# EasyEDA schematic 1-Schematic_NRF52832_Touch_Switch_1ch.json
TITLE: NRF52832_Touch_Switch_1ch; REV: 0.1; Date: 2019-11-19; Sheet: 1/1; Drawn By: mtiutiu; Company: TIU-TECH
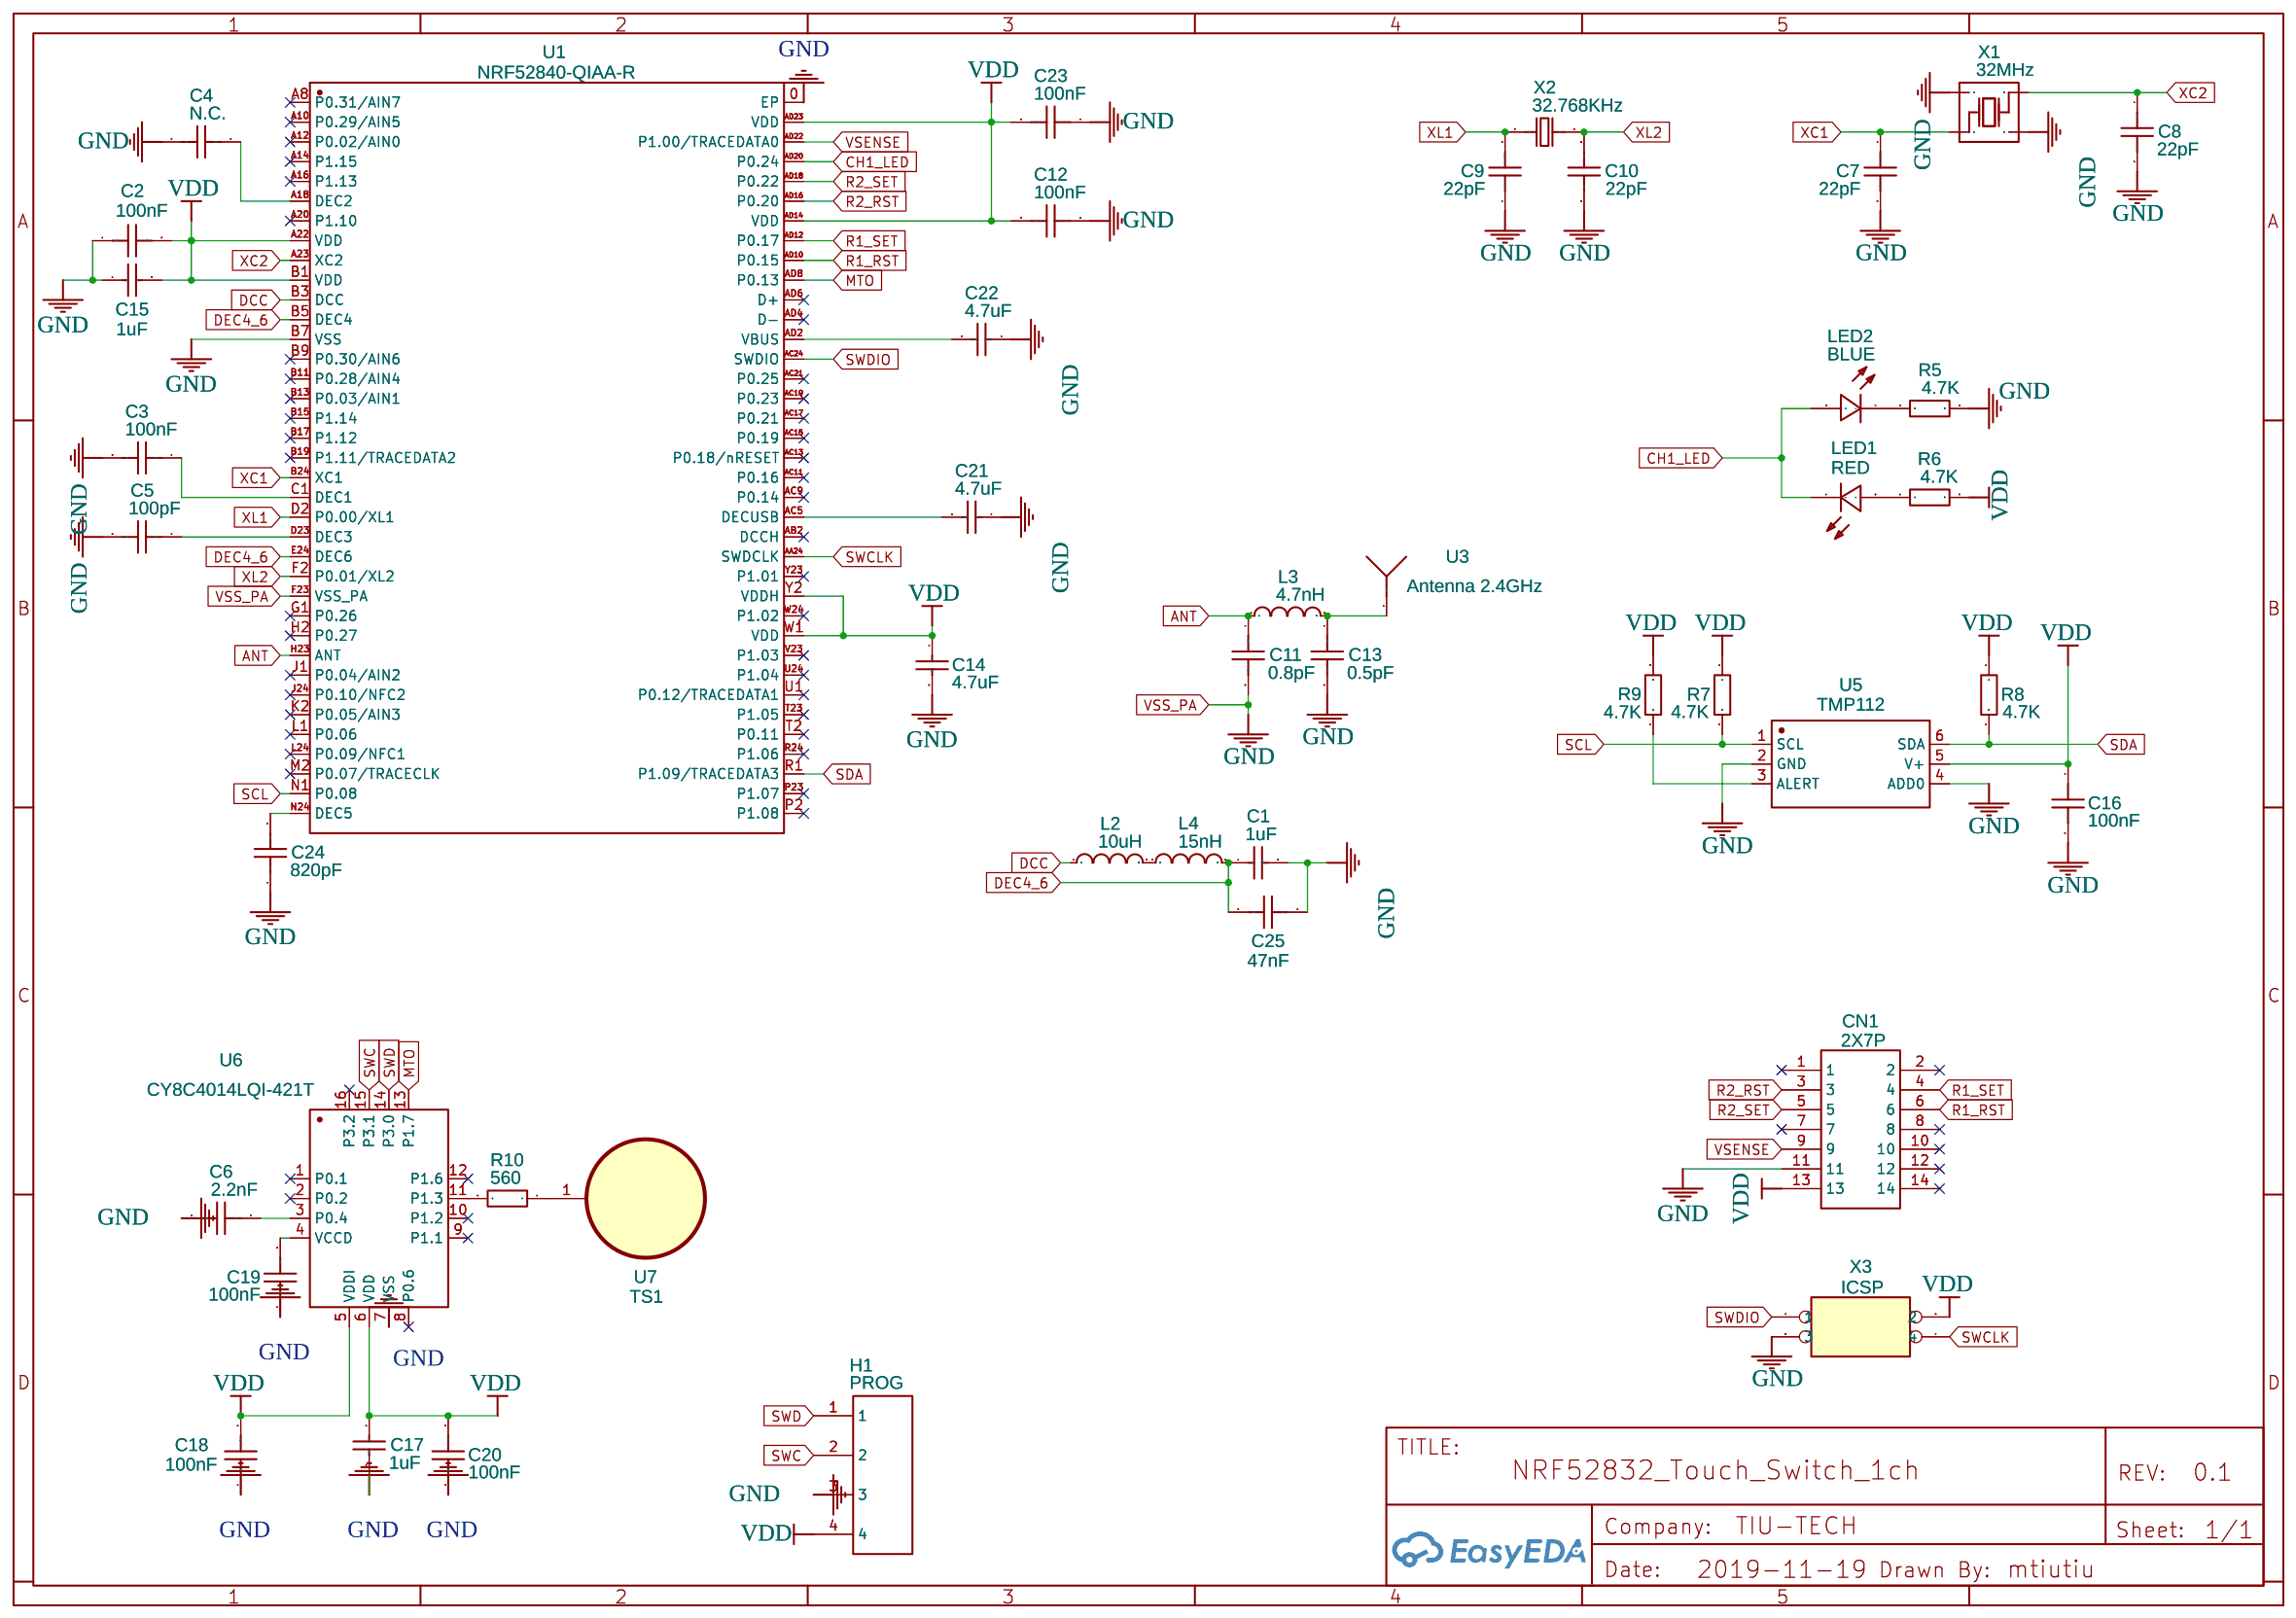
[diagram p0: schematic sheet]

## Parts
C1  1uF  [0603]
C2  100nF  [C0603]
C3  100nF  [C0603]
C4  N.C.  [0603]
C5  100pF  [0603]
C6  2.2nF  [C0603]
C7  22pF  [0603]
C8  22pF  [0603]
C9  22pF  [0603]
C10  22pF  [0603]
C11  0.8pF  [0402]
C12  100nF  [C0603]
C13  0.5pF  [0402]
C14  4.7uF  [0603]
C15  1uF  [0603]
C16  100nF  [C0603]
C17  1uF  [0603]
C18  100nF  [C0603]
C19  100nF  [C0603]
C20  100nF  [C0603]
C21  4.7uF  [0603]
C22  4.7uF  [0603]
C23  100nF  [C0603]
C24  820pF  [C0603]
C25  47nF  [C0603]
CN1  2X7P  [HDR-TH_14P-P2.00-V-R2-C7-S2.00_A2005HWV-2X7P]
H1  PROG  [CONNECTER_SMD_1.27_1X4_D180]
L2  10uH  [0603]
L3  4.7nH  [0603]
L4  15nH  [0402]
LED1  RED  [LED-SMD_0603-T]
LED2  BLUE  [LED-SMD_0603-T]
R5  4.7K  [R0603]
R6  4.7K  [R0603]
R7  4.7K  [R0603]
R8  4.7K  [R0603]
R9  4.7K  [R0603]
R10  560  [R0603]
U1  NRF52840-QIAA-R  [AQFN-73_L7.0-W7.0-P0.50-BL-EP4.8]
U3  Antenna 2.4GHz  [AN6520]
U5  TMP112  [SOT-563_L1.6-W1.2-P0.50-LS1.6-BL]
U6  CY8C4014LQI-421T  [QFN-16_L3.0-W3.0-P0.50-BL-EP1.7]
U7  TS1  [LIVOLO_TOUCH_PAD]
X1  32MHz  [OSC-SMD_4P-L2.0-W1.6-BL]
X2  32.768KHz  [FC-135R_L3.2-W1.5]
X3  ICSP  [SWD4_5032]

## Library data of the parts
C1 C15 C17 = CL10B105KO8NNNC: Supplier: LCSC; Manufacturer: SAMSUNG; Supplier Part: C59782
C2 C3 C6 C12 C16 C18-C20 C23 = C0603X104K050T: Supplier: LCSC; Supplier Part: C187860; Manufacturer: Holy Stone Enterprise; Contributor: LCSC
C4 C5 = TCC0603COG101J500CT: Supplier: LCSC; Supplier Part: C344186; Manufacturer: CCTC; Contributor: LCSC
C7-C10 = 0603N220J101: Supplier: LCSC; Manufacturer: WTC; Contributor: LCSC; Supplier Part: C152915
C11 C13 = CL05C0R5CB5NNNC: Supplier: LCSC; Manufacturer: SAMSUNG; Contributor: LCSC; Supplier Part: C86284; LCSC Assembly: Yes; SMT Type: Extend
C14 C21 C22 = CL10A475KQ8NNNC: Supplier: LCSC; Manufacturer: SAMSUNG; Supplier Part: C8032
C24 = 0603CG821J500NT: Supplier: LCSC; Manufacturer: FH; Supplier Part: C99081
C25 = GRM188B11C473KA01D: Supplier: LCSC; Supplier Part: C464442; Manufacturer: Murata Electronics; Contributor: LCSC
CN1 = -: Supplier: LCSC; Supplier Part: C225306; Manufacturer: Changjiang Connectors; Manufacturer Part: A2005HWV-2x7P; Contributor: LCSC
H1 = 1x4_Header_1.27mm_SMD: Manufacturer Part: 2x3 Header 1.27mm SMD; Contributor: cmarciales
L2 = MLZ1608M100WT000: Supplier: LCSC; Manufacturer: TDK; Supplier Part: C76798
L3 = VHF160808H3N3ST: Supplier: LCSC; Manufacturer: FH; Supplier Part: C1029; LCSC Assembly: Yes; SMT Type: Extend
L4 = SDCL1005C15NJTDF: Supplier: LCSC; Manufacturer: Sunlord; LCSC Assembly: Yes; Supplier Part: C27143; SMT Type: Basic
LED1 LED2 = -: Supplier: LCSC; Supplier Part: C389520; Manufacturer: MEIHUA; Manufacturer Part: MHT192UBCT; Contributor: LCSC
R5-R10 = RMC06034.7K5%N: Supplier: LCSC; Supplier Part: C269694; Manufacturer: Tyohm; Manufacturer Part: RMC06034.7k5%N; Contributor: LCSC
U1 = NRF52840-QIAA-R: Supplier: LCSC; Supplier Part: C190794; Manufacturer: Nordic Semicon; Contributor: LCSC
U3 = -: Supplier: LCSC; Supplier Part: C239238; Contributor: Fafex
U5 = TMP112AIDRLR: Supplier: LCSC; Manufacturer: TI; image: //image.lceda.cn/szlcsc/C28927.jpg; Supplier Part: C28927
U6 = CY8C4014LQI-421T
U7 = -: Contributor: mtiutiu
X1 = 7216-3200A1210-00: Supplier: LCSC; Supplier Part: C389799; Manufacturer: XTY; Contributor: LCSC
X2 = Q13FC1350000400: Supplier: LCSC; Manufacturer: EPSON; LCSC Assembly: Yes; Supplier Part: C32346; SMT Type: Basic

## Nets
GND: C1.2 C2.1 C3.2 C4.1 C5.2 C6.2 C7.2 C8.2 C9.1 C10.1 C11.2 C12.1 C13.2 C14.2 C15.1 C16.2 C17.1 C18.1 C19.1 C20.1 C21.1 C22.1 C23.1 C24.1 C25.1 CN1.11 H1.3 R5.2 U1.0(EP) U1.B7(VSS) U1.F23(VSS_PA) U5.2(GND) U5.4(ADD0) U6.7(VSS) X1.2 X1.4 X3.3
VDD: C2.2 C12.2 C14.1 C15.2 C16.1 C17.2 C18.2 C20.2 C23.2 CN1.13 H1.4 R6.2 R7.1 R8.1 R9.2 U1.A22(VDD) U1.AD14(VDD) U1.AD23(VDD) U1.B1(VDD) U1.W1(VDD) U1.Y2(VDDH) U5.5(V+) U6.5(VDDI) U6.6(VDD) X3.2
ANT: C11.1 L3.1 U1.H23(ANT)
CH1_LED: LED1.1(-) LED2.2(+) U1.AD20(P0.24)
DCC: L2.1 U1.B3(DCC)
DEC4_6: C1.1 C25.2 L4.2 U1.B5(DEC4) U1.E24(DEC6)
MTO: U1.AD8(P0.13) U6.13(P1.7)
R1_RST: CN1.6 U1.AD10(P0.15)
R1_SET: CN1.4 U1.AD12(P0.17)
R2_RST: CN1.3 U1.AD16(P0.20)
R2_SET: CN1.5 U1.AD18(P0.22)
SCL: R7.2 U1.N1(P0.08) U5.1(SCL)
SDA: R8.2 U1.R1(P1.09/TRACEDATA3) U5.6(SDA)
SWC: H1.2 U6.15(P3.1)
SWCLK: U1.AA24(SWDCLK) X3.4
SWD: H1.1 U6.14(P3.0)
SWDIO: U1.AC24(SWDIO) X3.1
VSENSE: CN1.9 U1.AD22(P1.00/TRACEDATA0)
XC1: C7.1 U1.B24(XC1) X1.1
XC2: C8.1 U1.A23(XC2) X1.3
XL1: C9.2 U1.D2(P0.00/XL1) X2.1
XL2: C10.2 U1.F2(P0.01/XL2) X2.2
Net-(C3-1): C3.1 U1.C1(DEC1)
Net-(C4-2): C4.2 U1.A18(DEC2)
Net-(C5-1): C5.1 U1.D23(DEC3)
Net-(C6-1): C6.1 U6.3(P0.4)
Net-(C13-1): C13.1 L3.2 U3.1
Net-(C19-2): C19.2 U6.4(VCCD)
Net-(C21-2): C21.2 U1.AC5(DECUSB)
Net-(C22-2): C22.2 U1.AD2(VBUS)
Net-(C24-2): C24.2 U1.N24(DEC5)
Net-(L2-2): L2.2 L4.1
Net-(LED1-2): LED1.2(+) R6.1
Net-(LED2-1): LED2.1(-) R5.1
Net-(R9-1): R9.1 U5.3(ALERT)
Net-(R10-1): R10.1 U7.1
Net-(R10-2): R10.2 U6.11(P1.3)

Not connected (* = marked no-connect by the designer): CN1 1* 2* 7* 8* 10* 12* 14*; U1 A8(P0.31/AIN7)* A10(P0.29/AIN5)* A12(P0.02/AIN0)* A14(P1.15)* A16(P1.13)* A20(P1.10)* AB2(DCCH)* AC9(P0.14)* AC11(P0.16)* AC13(P0.18/nRESET)* AC15(P0.19)* AC17(P0.21)* AC19(P0.23)* AC21(P0.25)* AD4(D-)* AD6(D+)* B9(P0.30/AIN6)* B11(P0.28/AIN4)* B13(P0.03/AIN1)* B15(P1.14)* B17(P1.12)* B19(P1.11/TRACEDATA2)* G1(P0.26)* H2(P0.27)* J1(P0.04/AIN2)* J24(P0.10/NFC2)* K2(P0.05/AIN3)* L1(P0.06)* L24(P0.09/NFC1)* M2(P0.07/TRACECLK)* P2(P1.08)* P23(P1.07)* R24(P1.06)* T2(P0.11)* T23(P1.05)* U1(P0.12/TRACEDATA1)* U24(P1.04)* V23(P1.03)* W24(P1.02)* Y23(P1.01)*; U6 1(P0.1)* 2(P0.2)* 8(P0.6)* 9(P1.1)* 10(P1.2)* 12(P1.6)* 16(P3.2)*
